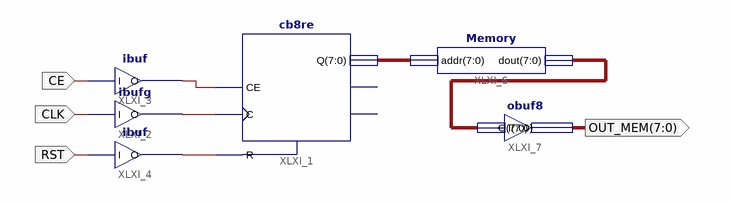
[diagram p0: schematic sheet 1]
// Xilinx ISE schematic count_mem.sch (spartan3e) as structural Verilog: 6 symbols, 4 ports
module count_mem (
  input  CE,
  input  CLK,
  input  RST,
  output [7:0] OUT_MEM
);

  wire XLXN_4, XLXN_5, XLXN_6;
  wire [7:0] XLXN_8, XLXN_9;

  cb8re XLXI_1 (.C(XLXN_5), .CE(XLXN_4), .R(XLXN_6), .Q(XLXN_8));  // open: CEO, TC
  ibufg XLXI_2 (.I(CLK), .O(XLXN_5));
  ibuf XLXI_3 (.I(CE), .O(XLXN_4));
  ibuf XLXI_4 (.I(RST), .O(XLXN_6));
  Memory XLXI_6 (.addr(XLXN_8), .dout(XLXN_9));
  obuf8 XLXI_7 (.I(XLXN_9), .O(OUT_MEM));
endmodule
